# EAGLE design AEMLIC V4 (EAGLE 9.6.2)
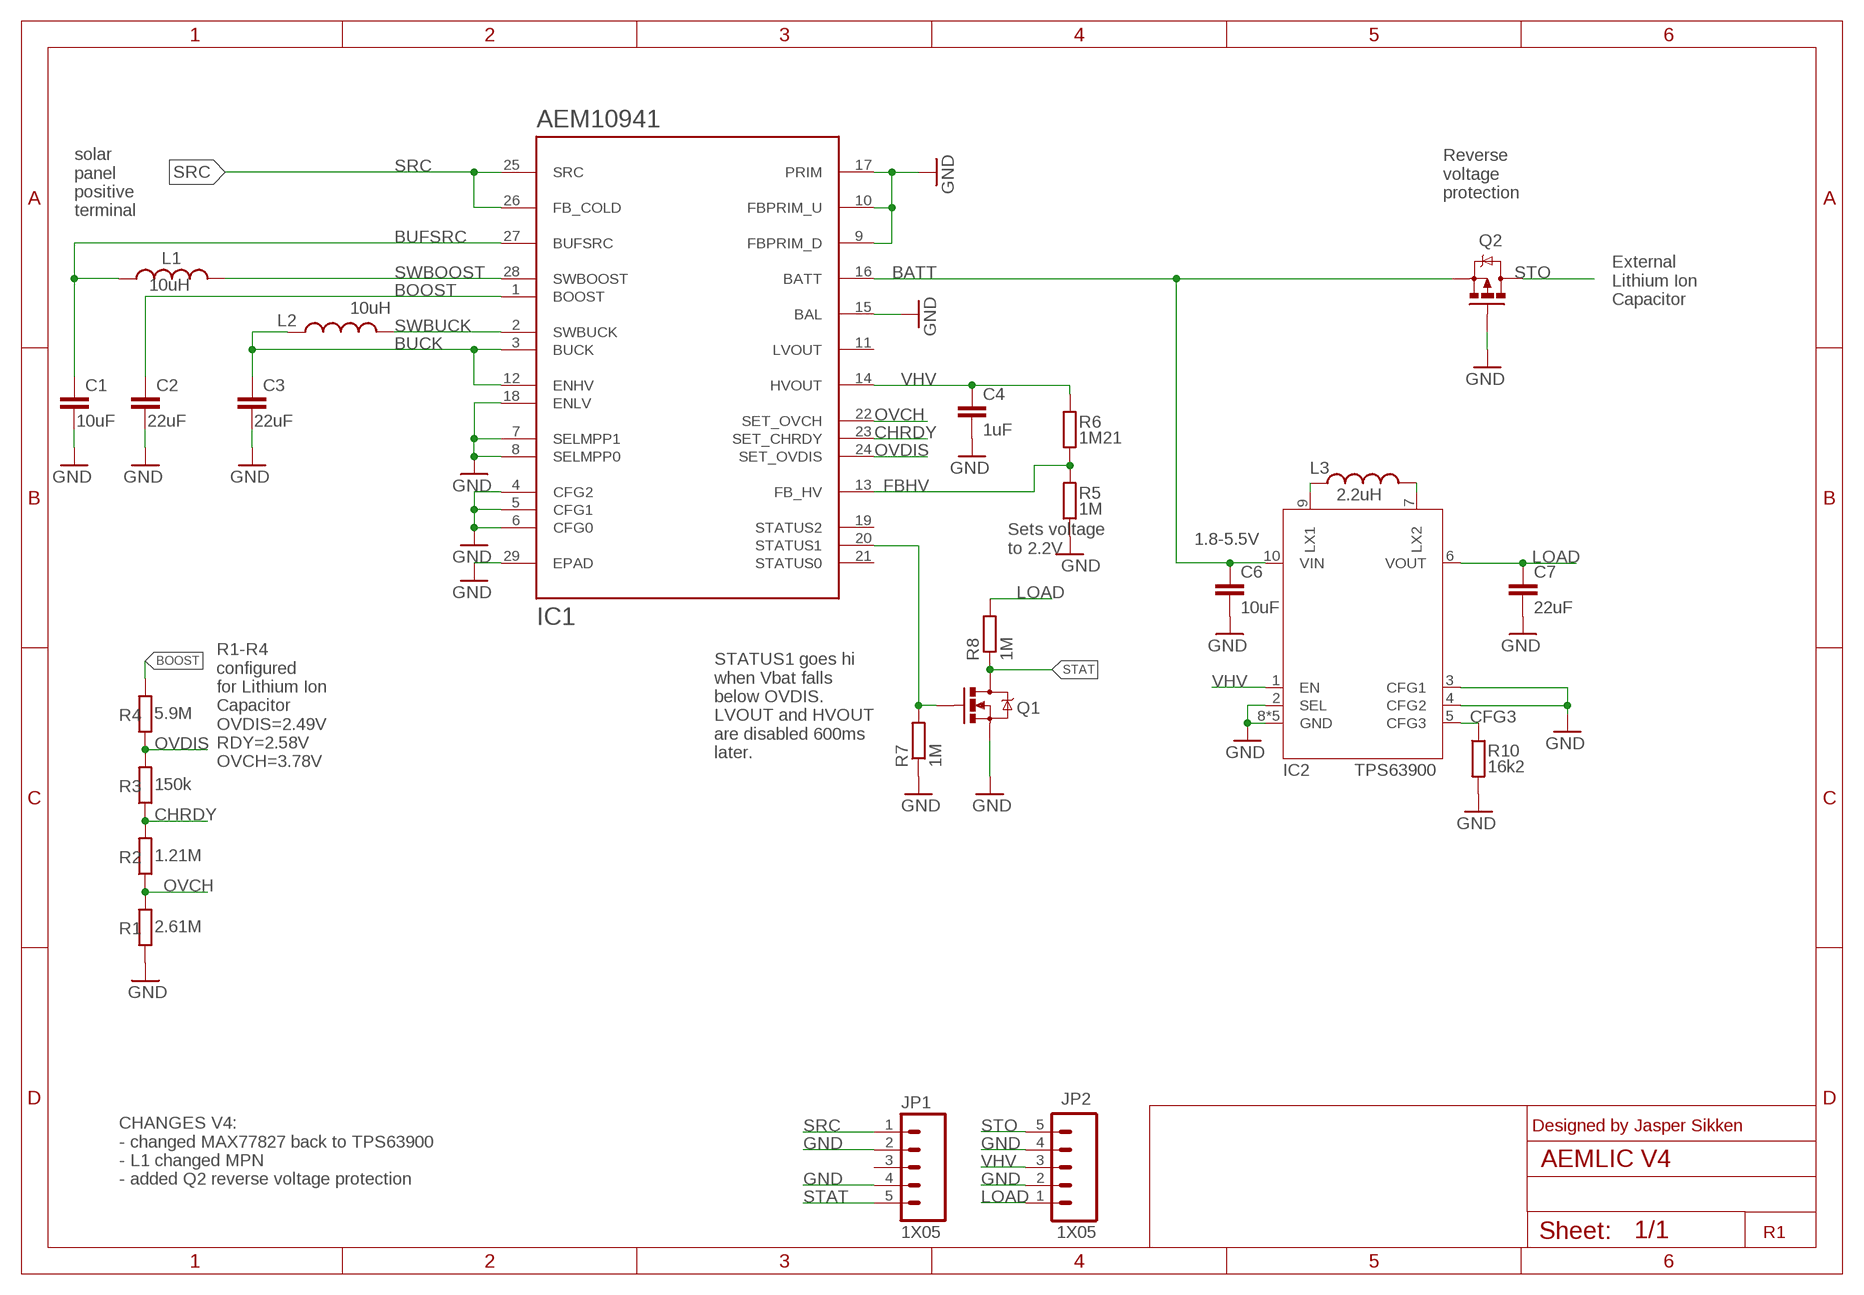
[diagram p0: schematic, sheet 1]

## Parts
C1  10uF  C0603_10UF  [C0603]
C2  22uF  C0603_22UF  [C0603]
C3  22uF  C0603_10UF  [C0603]
C4  1uF  C0603_10UF  [C0603]
C6  10uF  C0603_10UF  [C0603]
C7  22uF  C0603_22UF  [C0603]
IC1  AEM10941  [QFN50P505X505X90-28]
IC2  TPS63900  [WSON10]
JP1  1X05  [1X05_2.54MM_ROUND_NOSILK]
JP2  1X05  [1X05_2.54MM_ROUND_NOSILK]
L1  10uH  L4  [L_3225MM]
L2  10uH  L0603_10UH  [L0603]
L3  2.2uH  L2  [L_1008_[2520]]
Q1  DMG1012UW  MOSFET-N-CHANNEL_DMG1012UW  [SOT323]
Q2  DMP2160UW  MOSFET-P-CHANNEL-DMP2160UW  [SOT323]
R1  2.61M  R0402_1M  [R0402]
R2  1.21M  R0402_1M  [R0402]
R3  150k  R0402_1M  [R0402]
R4  5.9M  R0402_1M  [R0402]
R5  1M  R0402_1M  [R0402]
R6  1M21  R0402_1M  [R0402]
R7  1M  R0402_1M  [R0402]
R8  1M  R0402_1M  [R0402]
R10  16k2  R0402_10K  [R0402]

## Nets
BATT: C6.1 IC1.16(BATT) IC2.10(VIN) Q2.2(S)
BOOST: C2.1 IC1.1(BOOST) R4.2
BUCK: C3.1 IC1.3(BUCK) IC1.12(ENHV) L2.1
BUFSRC: C1.1 IC1.27(BUFSRC) L1.1
CFG3: IC2.5(CFG3) R10.1
CHRDY: IC1.23(SET_CHRDY) R2.2 R3.1
FBHV: IC1.13(FB_HV) R5.2 R6.1
GND: C1.2 C2.2 C3.2 C4.2 C6.2 C7.2 IC1.4(CFG2) IC1.5(CFG1) IC1.6(CFG0) IC1.7(SELMPP1) IC1.8(SELMPP0) IC1.9(FBPRIM_D) IC1.10(FBPRIM_U) IC1.15(BAL) IC1.17(PRIM) IC1.18(ENLV) IC1.29(EPAD) IC2.2(SEL) IC2.3(CFG1) IC2.4(CFG2) IC2.8(GND) IC2.29(GND) IC2.P$2(GND) IC2.P$4(GND) IC2.P$5(GND) JP1.2 JP1.4 JP2.2 JP2.4 Q1.2(S) Q2.1(G) R1.1 R5.1 R7.1 R10.2
LOAD: C7.1 IC2.6(VOUT) JP2.1 R8.2
N$2: IC2.9(LX1) L3.1
N$3: IC2.7(LX2) L3.2
OVCH: IC1.22(SET_OVCH) R1.2 R2.1
OVDIS: IC1.24(SET_OVDIS) R3.2 R4.1
SRC: IC1.25(SRC) IC1.26(FB_COLD) JP1.1
STAT: JP1.5 Q1.3(D) R8.1
STATUS1: IC1.20(STATUS1) Q1.1(G) R7.2
STO: JP2.5 Q2.3(D)
SWBOOST: IC1.28(SWBOOST) L1.2
SWBUCK: IC1.2(SWBUCK) L2.2
VHV: C4.1 IC1.14(HVOUT) IC2.1(EN) JP2.3 R6.2
Unconnected: IC1.11(LVOUT) IC1.19(STATUS2) IC1.21(STATUS0) JP1.3

## Notes on the sheet
- Reverse 
  voltage 
  protection
- solar
  panel
  positive
  terminal
- External 
  Lithium Ion 
  Capacitor
- 1.8-5.5V
- Sets voltage 
  to 2.2V
- STATUS1 goes hi 
  when Vbat falls 
  below OVDIS. 
  LVOUT and HVOUT
  are disabled 600ms
  later.
- R1-R4 
  configured 
  for Lithium Ion 
  Capacitor
  OVDIS=2.49V
  RDY=2.58V
  OVCH=3.78V
- Designed by Jasper Sikken
- CHANGES V4:
  - changed MAX77827 back to TPS63900
  - L1 changed MPN
  - added Q2 reverse voltage protection
- R1

## Library data of the parts
C1 = TSEM:C: Non-polarized capacitor; FARNELL_OC: 2113070; MF: KEYSTONE; MPN: 1049P; OC_NEWARK: 53Y2625
C2 = TSEM:C: Non-polarized capacitor; FARNELL_OC: 2426957; MF: TDK; MPN: CGA5L1X7S1A226M160AC; OC_NEWARK: 71AH2845; VALUE: 22uF 10V
C3 = TSEM:C: Non-polarized capacitor; FARNELL_OC: 2113070; MF: KEYSTONE; MPN: 1049P; OC_NEWARK: 53Y2625; VALUE: 10uF
C4 = TSEM:C: Non-polarized capacitor; FARNELL_OC: 2113070; MF: Taiyo Yuden; MPN: LMK107BBJ106MALT; VALUE: 10uF
C6 = JaspersEagleLibrary:C: Non-polarized capacitor; FARNELL_OC: 2113070; MF: Taiyo Yuden; MPN: LMK107BBJ106MALT
C7 = JaspersEagleLibrary:C: Non-polarized capacitor; FARNELL_OC: 2426957; MF: Murata; MPN: GRM188R61A226ME15D; VALUE: 22uF 10V
IC1 = TSEM:AEM10941: Ambient Energy Manager from e-peas; OC_NEWARK: unknown
IC2 = JaspersEagleLibrary:TPS63900: TPS63900 1.8-V to 5.5-V, 75-nA IQ Buck-boost Converter with Input Current Limit and DVS
JP1 JP2 = TSEM:1X05; OC_NEWARK: unknown
L1 = JaspersEagleLibrary:L: Inductor; MF: Murata; MPN: DFE322512F-100M=P2
L2 = TSEM:L: Inductor; FARNELL_OC: 2215635; MF: TAIYO YUDEN; MPN: CK2125100M-T; OC_NEWARK: 25AC6883
L3 = TSEM:L: Inductor; MF: Murata; MPN: DFE252012F-2R2M=P2
Q1 = TSEM:MOSFET-N-CHANNEL: Mosfet N channel; FARNELL_OC: 2061403; OC_NEWARK: unknown
Q2 = TSEM_R2A:MOSFET-P-CHANNEL: MOSFET P Channel; FARNELL_OC: 1858672; OC_NEWARK: unknown
R1-R4 R6 = TSEM:R: Resistor; FARNELL_OC: 2502499; OC_NEWARK: unknown; VALUE: 1M
R5 R7 R8 = TSEM:R: Resistor; FARNELL_OC: 2502499; OC_NEWARK: unknown
R10 = JaspersEagleLibrary:R: Resistor; FARNELL_OC: 2447096; OC_NEWARK: unknown; VALUE: 10k

## Board
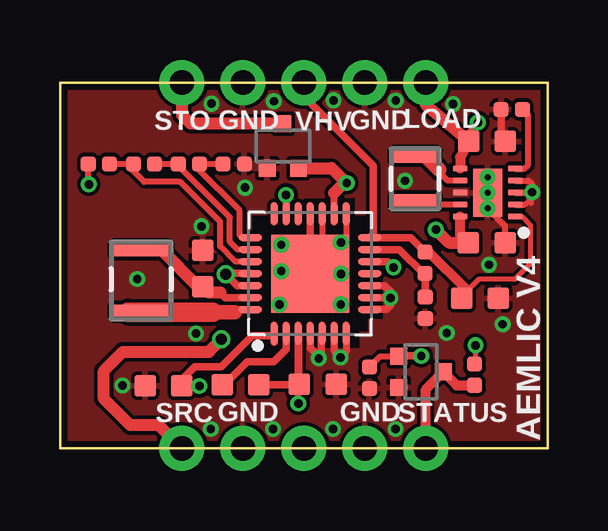
[diagram p1: board, top side]
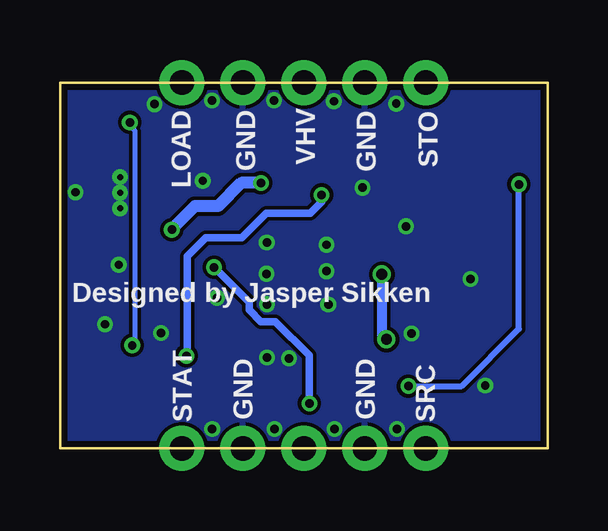
[diagram p2: board, bottom side, seen from below]

Size 20.32 x 15.24 mm. Coordinates in mm from the lower left corner, seen from the top.
Outline: 0,0 0,15.24 20.32,15.24 20.32,0 0,0
Copper layers (1*16): Top 0.035mm / dielectric 1.6mm / Bottom 0.035mm
Design rules "Elecrow_2-layer_PCB_eagle_rule": minimum track width 6mil, minimum drill 12mil, track to track 6mil, track to pad 6mil, pad to pad 6mil, via to via 8mil, smd to smd 0mil, copper to edge 0.25mm, drill to drill 10mil, minimum pad ring 6mil, minimum via ring 6mil, stop-mask expansion 0mil, vias tented up to drill 100mil, thermal gap 6mil
tRestrict: area 12.4,5.4 to 13.4,7; area 10.2,4.2 to 11.4,5.2; area 11.7,9.7 to 12.3,10.4; area 11.3,4.2 to 12.5,5.2; area 10.2,9.3 to 11.2,10.4; area 18.4,10 to 19.3,11.4

### Footprints (pad centres in the part's own frame; a part is rotated, then mirrored left to right if it is on the bottom)
C0603 = smd 0.889 x 0.889: 1 -0.762,0; 2 0.762,0
QFN50P505X505X90-28 = smd 0.977 x 0.292: 1 -2.486,1.5; 2 -2.486,1; 3 -2.486,0.5; 4 -2.486,0; 5 -2.486,-0.5; 6 -2.486,-1; 7 -2.486,-1.5; 15 2.486,-1.5; 16 2.486,-1; 17 2.486,-0.5; 18 2.486,0; 19 2.486,0.5; 20 2.486,1; 21 2.486,1.5 | smd 0.292 x 0.977: 8 -1.5,-2.486; 9 -1,-2.486; 10 -0.5,-2.486; 11 0,-2.486; 12 0.5,-2.486; 13 1,-2.486; 14 1.5,-2.486; 22 1.5,2.486; 23 1,2.486; 24 0.5,2.486; 25 0,2.486; 26 -0.5,2.486; 27 -1,2.486; 28 -1.5,2.486 | smd 3.25 x 3.25: 29 0,0
WSON10 = smd 0.6 x 0.25: 1 -1.15,1; 2 -1.15,0.5; 3 -1.15,0; 4 -1.15,-0.5; 5 -1.15,-1; 6 1.15,-1; 7 1.15,-0.5; 8 1.15,0; 9 1.15,0.5; 10 1.15,1 | smd 1.2 x 2: 29 0,0 | drill 0.25 pad 0.65: P$2 0,0; P$4 0,-0.65; P$5 0,0.65
1X05_2.54MM_ROUND_NOSILK = drill 1.016 pad 1.88: 1 0,0; 2 2.54,0; 3 5.08,0; 4 7.62,0; 5 10.16,0
L_3225MM = smd 0.6 x 2.5: 1 -1.25,0; 2 1.35,0
L0603 = smd 0.889 x 0.889: 1 -0.762,0; 2 0.762,0
L_1008_[2520] = smd 0.6 x 2: 1 -0.95,0; 2 0.95,0
SOT323 = smd 0.7 x 0.7: 1 -0.65,-0.925; 2 0.65,-0.925; 3 0,0.925
R0402 = smd 0.635 x 0.635: 1 -0.445,0; 2 0.445,0

### Placement (x,y rotation side)
C1  5.95,7.5 90 top
C2  4.31,2.6 180 top
C3  10.74,2.66 0 top
C4  17.5,6.25 0 top
C6  17.78,8.57 0 top
C7  17.8,12.8 0 top
IC1  10.42,7.28 90 top
IC2  17.82,10.65 180 top
JP1  5.08,0 0 top
JP2  15.24,15.24 180 top
L1  3.38,7.04 270 top
L2  7.52,2.64 180 top
L3  14.8,11.24 90 top
Q1  15.04,3.19 270 top
Q2  9.29,12.6 0 top
R1  7.24,11.85 180 top
R2  5.37,11.85 180 top
R3  3.5,11.85 180 top
R4  1.62,11.85 180 top
R5  15.22,5.86 90 top
R6  15.21,7.73 90 top
R7  12.89,2.94 90 top
R8  17.27,3.07 90 top
R10  18.82,14.12 180 top

### Tracks (layer width: path | path; a pad name or v marks a point on that pad's centre or on a via)
BATT  (via drill 0.35 pad 0.65)
  Top 0.3: IC1.16 11.42,10.64 | 11.93,11.06 v11.95,11.06
  Top 0.305: C6.1 16.67,8.92
  Top 0.406: 16.67,8.92 IC2.10
  Top 0.508: Q2.2 11.31,11.68 11.93,11.06 | v15.66,9.11 16.2,8.57 C6.1 | 11.42,10.64 11.84,11.06 v11.95,11.06
  Bottom 0.3: v15.67,9.12 v15.66,9.11
  Bottom 0.508: v11.95,11.06 12.76,11.06 13.73,10.09 14.7,10.09 v15.67,9.12
BOOST  (via drill 0.35 pad 0.65)
  Top 0.254: v1.2,11 1.18,11.02 R4.2
  Top 0.305: 8.92,4.41 IC1.1 8.83,4.7 8.02,4.7 6.72,3.4 5.61,3.4 5.07,2.86 C2.1 v5.8,2.6
  Bottom 0.254: v5.8,2.6 3.58,2.6 1.2,4.98 v1.2,11
BUCK  (via drill 0.35 pad 0.65)
  Top 0.254: v9.93,1.87 9.93,2.88 9.94,2.89
  Top 0.305: v13.9,7.54 13.66,7.78 IC1.12 | 9.94,2.89 9.94,4.77 IC1.3 9.92,2.72 C3.1 9.96,2.64 L2.1
  Bottom 0.305: v9.93,1.87 v9.94,1.88 9.94,3.87 11.35,5.28 11.95,5.28 12.44,5.77 12.44,6.08 v13.9,7.54
BUFSRC
  Top 0.305: IC1.27 6.89,6.28 6.68,6.49
  Top 0.5: 4.24,8.27 3.4,8.27 L1.1
  Top 0.508: 6.68,6.49 6.19,6.49 C1.1 5.77,6.74 4.24,8.27
  Top 0.813: C1.1
CFG3
  Top 0.254: IC2.5 19.35,11.65 19.5,11.8 19.5,13.88 R10.1
CHRDY
  Top 0.254: IC1.23 7.4,8.28 7.08,8.61 7.08,9.62 4.93,11.77 R2.2 R3.1
FBHV
  Top 0.305: 15.16,6.36 R5.2 15.21,6.31 R6.1 15.17,7.24 14.13,8.28 IC1.13
GND  (via drill 0.35 pad 0.65)
  Top 0.152: 10.04,7.85 9.57,7.38 v9.22,7.38 | 10.04,7.85 10.04,7.66 IC1.29 10.42,7.48 10.04,7.85 | R10.2 18.16,14.34
  Top 0.203: v19.67,10.67 19.63,10.62 19.63,10.21 | 19.89,10.68 19.36,10.15
  Top 0.254: C6.2 18.54,9.26 17.82,9.98 IC2.P$5 | IC2.4 19.52,11.15 19.67,11 v19.67,10.67 19.65,10.65 IC2.3 19.69,10.65 19.72,10.68 19.89,10.68 | IC2.2 19.36,10.15 | IC1.15 11.92,8.79 v11.7,8.57 | IC1.29 10.42,7.87 11.12,8.57 10.92,8.77 IC1.17
  Top 0.3: IC1.7 11.92,4.01 v11.69,3.78
  Top 0.305: 11.42,6.28 IC1.29 | IC1.4 10.42,4.18 10.78,3.82 v10.78,3.75 10.89,3.86 10.89,4.76 IC1.5 | IC1.6 11.42,4.06 v11.69,3.79 v11.69,3.78 | IC1.18 10.42,8.66 10.24,8.48 v9.22,8.48 | IC1.10 13.52,6.78 13.77,6.53 v13.77,6.27 | IC1.9 v13.76,6.28 v13.77,6.27 | v13.77,6.27 13.77,5.97 13.6,5.8 12.93,5.8 IC1.8 | R10.2 18.38,12.99 C7.2
  Top 0.508: IC1.29 v11.7,8.57
  other vias: 9.14,5.99 11.7,6 11.71,7.27 7.71,10.86 2.6,2.62 5.67,4.78 3.22,7.06 5.9,9.25 8.91,14.46 6.31,14.36 11.4,14.5 13.99,14.49 6.28,0.81 8.88,0.81 11.38,0.81 13.98,0.81 16.38,14.34 18.44,5.17 17.87,7.65 14.37,11.15 16.11,4.81
  pour Top: 0,15.24 20.32,15.24 20.32,0 0,0
  pour Bottom: 0,15.24 20.32,15.24 20.32,0 0,0
LOAD  (via drill 0.35)
  Top 0.203: C7.1 17.04,13.18 17.41,13.55 v17.41,13.58 | v17.31,4.29 17.31,3.55 R8.2
  Top 0.406: C7.1 16.67,12.14 IC2.6
  Top 0.508: JP2.1 15.24,14.32 C7.1
  Bottom 0.203: v17.41,13.58 17.41,13.44 17.21,13.24 17.21,4.29 v17.31,4.29
N$2
  Top 0.254: IC2.9 14.94,10.15 L3.1
N$3
  Top 0.254: IC2.7 16.15,11.15 15.8,11.5 15.8,11.6
  Top 0.61: 15.11,12.19 L3.2 15.21,12.19 15.8,11.6
OVCH
  Top 0.254: IC1.22 7.59,8.78 7.48,8.89 7.48,9.92 5.7,11.7 5.7,11.74 R2.1 R1.2
OVDIS
  Top 0.254: IC1.24 7.31,7.78 6.67,8.42 6.67,9.43 5,11.1 3.5,11.1 3,11.6 3,11.79 3,11.8 | 3,11.8 R3.2 | R4.1 2.95,11.85 3,11.8
SRC  (via drill 0.45 pad 0.65, 0.45 pad 0.75)
  Top 0.305: IC1.25 6.95,7.29 v6.91,7.25 7.38,6.78 IC1.26
  Top 0.508: JP1.1 4.11,0.97 2.93,0.97 1.83,2.07 1.83,3.23 2.62,4.02 6.2,4.02 v6.72,4.54
  Bottom 0.406: v6.91,7.25 6.91,4.73 v6.72,4.54
STAT
  Top 0.406: JP1.5 15.24,2.46 Q1.3 16.53,2.63 R8.1
STATUS1  (via drill 0.35 pad 0.65)
  Top 0.254: R7.2 13.34,3.84 Q1.1
  Top 0.305: IC1.20 9.42,10.28 | 9.42,10.28 | 9.42,10.28 v9.42,10.56 | v15.05,3.85 14.13,3.85 Q1.1
  Bottom 0.305: v9.42,10.56 9.42,10.27 9.9,9.79 11.73,9.79 12.75,8.77 14.24,8.77 15.02,8 15.02,3.82 v15.05,3.85
STO
  Top 0.508: Q2.3 5.45,13.53 5.08,13.89 JP2.5
SWBOOST
  Top 0.152: L1.2 3.36,5.67 2.82,5.67
  Top 0.305: IC1.28 7.39,5.78 7.28,5.67
  Top 0.61: 7.28,5.67 6.36,5.67
  Top 0.813: 2.82,5.67 6.36,5.67
SWBUCK
  Top 0.305: L2.2 6.84,2.64 7.8,3.6 8.9,3.6 9.42,4.12 IC1.2
VHV
  Top 0.203: IC2.1 19.25,9.65 19.6,9.3 19.6,7.7 18.94,7.04 17.44,7.04 16.93,6.53
  Top 0.305: JP2.3 10.33,15.07 10.33,14.5 13.05,11.78 13.05,8.92 IC1.14 14.6,8.78 R6.2 | 16.93,6.53 C4.1
  Top 0.406: C4.1 16.93,6.62 15.37,8.18 R6.2

### Text on the board
tPlace: STO | GND | VHV | GND | LOAD | SRC | GND | GND | STATUS | AEMLIC V4
bPlace: STO | GND | VHV | GND | LOAD | Designed by Jasper Sikken | SRC | GND | GND | STAT